# Altium project HumTemp ESP32.PrjPcb
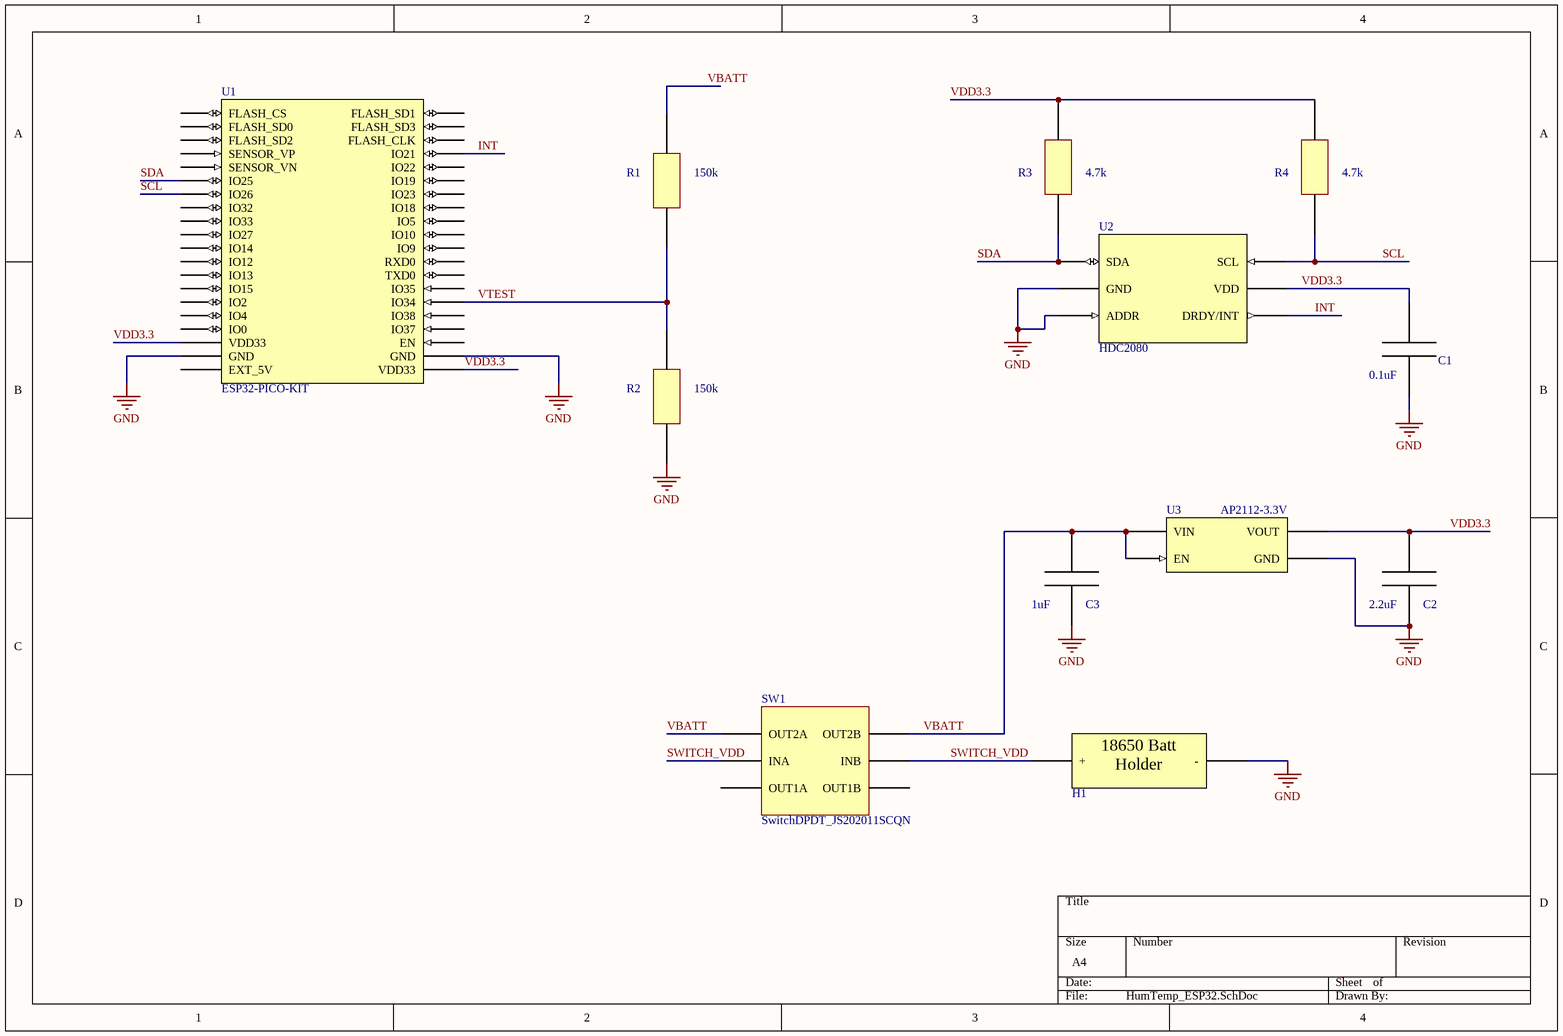
[diagram p0: HumTemp_ESP32.SchDoc]
1 sheet, 12 parts. Net scope: global (net labels, ports and power ports of the same name join across sheets).
Board file: HumTemp_ESP32.PcbDoc

## Sheet HumTemp_ESP32.SchDoc
size A4

### Parts
C1  value 0.1uF  [CAPCERAMIC_SMD_2012M_0805I]  (hidden comment: SMD Capacitor)
C2  value 2.2uF  [CAPCERAMIC_SMD_2012M_0805I]  (hidden comment: SMD Capacitor)
C3  value 1uF  [CAPCERAMIC_SMD_2012M_0805I]  (hidden comment: SMD Capacitor)
H1  18650 Battery holder - Keystone  [18650_BATTERYHOLDER]  (value not drawn)
R1  value 150k  [RES_SMD_2012M-0805I]  (hidden comment: SMD Resistor)
R2  value 150k  [RES_SMD_2012M-0805I]  (hidden comment: SMD Resistor)
R3  value 4.7k  [RES_SMD_2012M-0805I]  (hidden comment: SMD Resistor)
R4  value 4.7k  [RES_SMD_2012M-0805I]  (hidden comment: SMD Resistor)
SW1  SwitchDPDT_JS202011SCQN  [SWITCHDPDT]
U1  ESP32-PICO-KIT  [ESP32-PICO-KIT]
U2  HDC2080  [WSON6]
U3  AP2112-3.3V  [SOT95P285X110-5M]

### Nets
GND: C1.1 C2.1 C3.1 H1.1(-) R2.1 U1.19(GND) U1.39(GND) U2.2(GND) U2.3(ADDR) U3.2(GND)
INT: U1.24(IO21) U2.4(DRDY/INT)
SCL: R4.1 U1.7(IO26) U2.6(SCL)
SDA: R3.1 U1.6(IO25) U2.1(SDA)
SWITCH_VDD: H1.2(+) SW1.1(INA) SW1.4(INB)
VBATT: C3.2 R1.2 SW1.2(OUT2A) SW1.5(OUT2B) U3.1(VIN) U3.3(EN)
VDD3.3: C1.2 C2.2 R3.2 R4.2 U1.18(VDD33) U1.40(VDD33) U2.5(VDD) U3.5(VOUT)
VTEST: R1.1 R2.2 U1.35(IO34)

Not connected (* = marked no-connect by the designer): SW1 0(OUT1A) 3(OUT1B); U1 1(FLASH_CS) 2(FLASH_SD0) 3(FLASH_SD2) 4(SENSOR_VP) 5(SENSOR_VN) 8(IO32) 9(IO33) 10(IO27) 11(IO14) 12(IO12) 13(IO13) 14(IO15) 15(IO2) 16(IO4) 17(IO0) 20(EXT_5V) 21(FLASH_SD1) 22(FLASH_SD3) 23(FLASH_CLK) 25(IO22) 26(IO19) 27(IO23) 28(IO18) 29(IO5) 30(IO10) 31(IO9) 32(RXD0) 33(TXD0) 34(IO35) 36(IO38) 37(IO37) 38(EN)

### Notes on the sheet
- (in symbol 18650 Battery holder - Keystone) 18650 Batt / Holder

### Library data of the parts
C1-C3 = capceramic_SMD: Ceramic SMD capacitor
H1 = 18650 Battery holder - Keystone: Codice KEYSTONE: 1043; Codice MOUSER: 534-1043
R1-R4 = resistor_SMD
U2 = HDC2080: High precision humidity and temperature sensor
U3 = AP2112-3.3V: AP2112 - 3.3V voltage regulator; Constructore code: AP2112K-3.3TRG1; RS CODE: 828-3509